# EAGLE design capelet_kinetic (EAGLE 9.5.2)
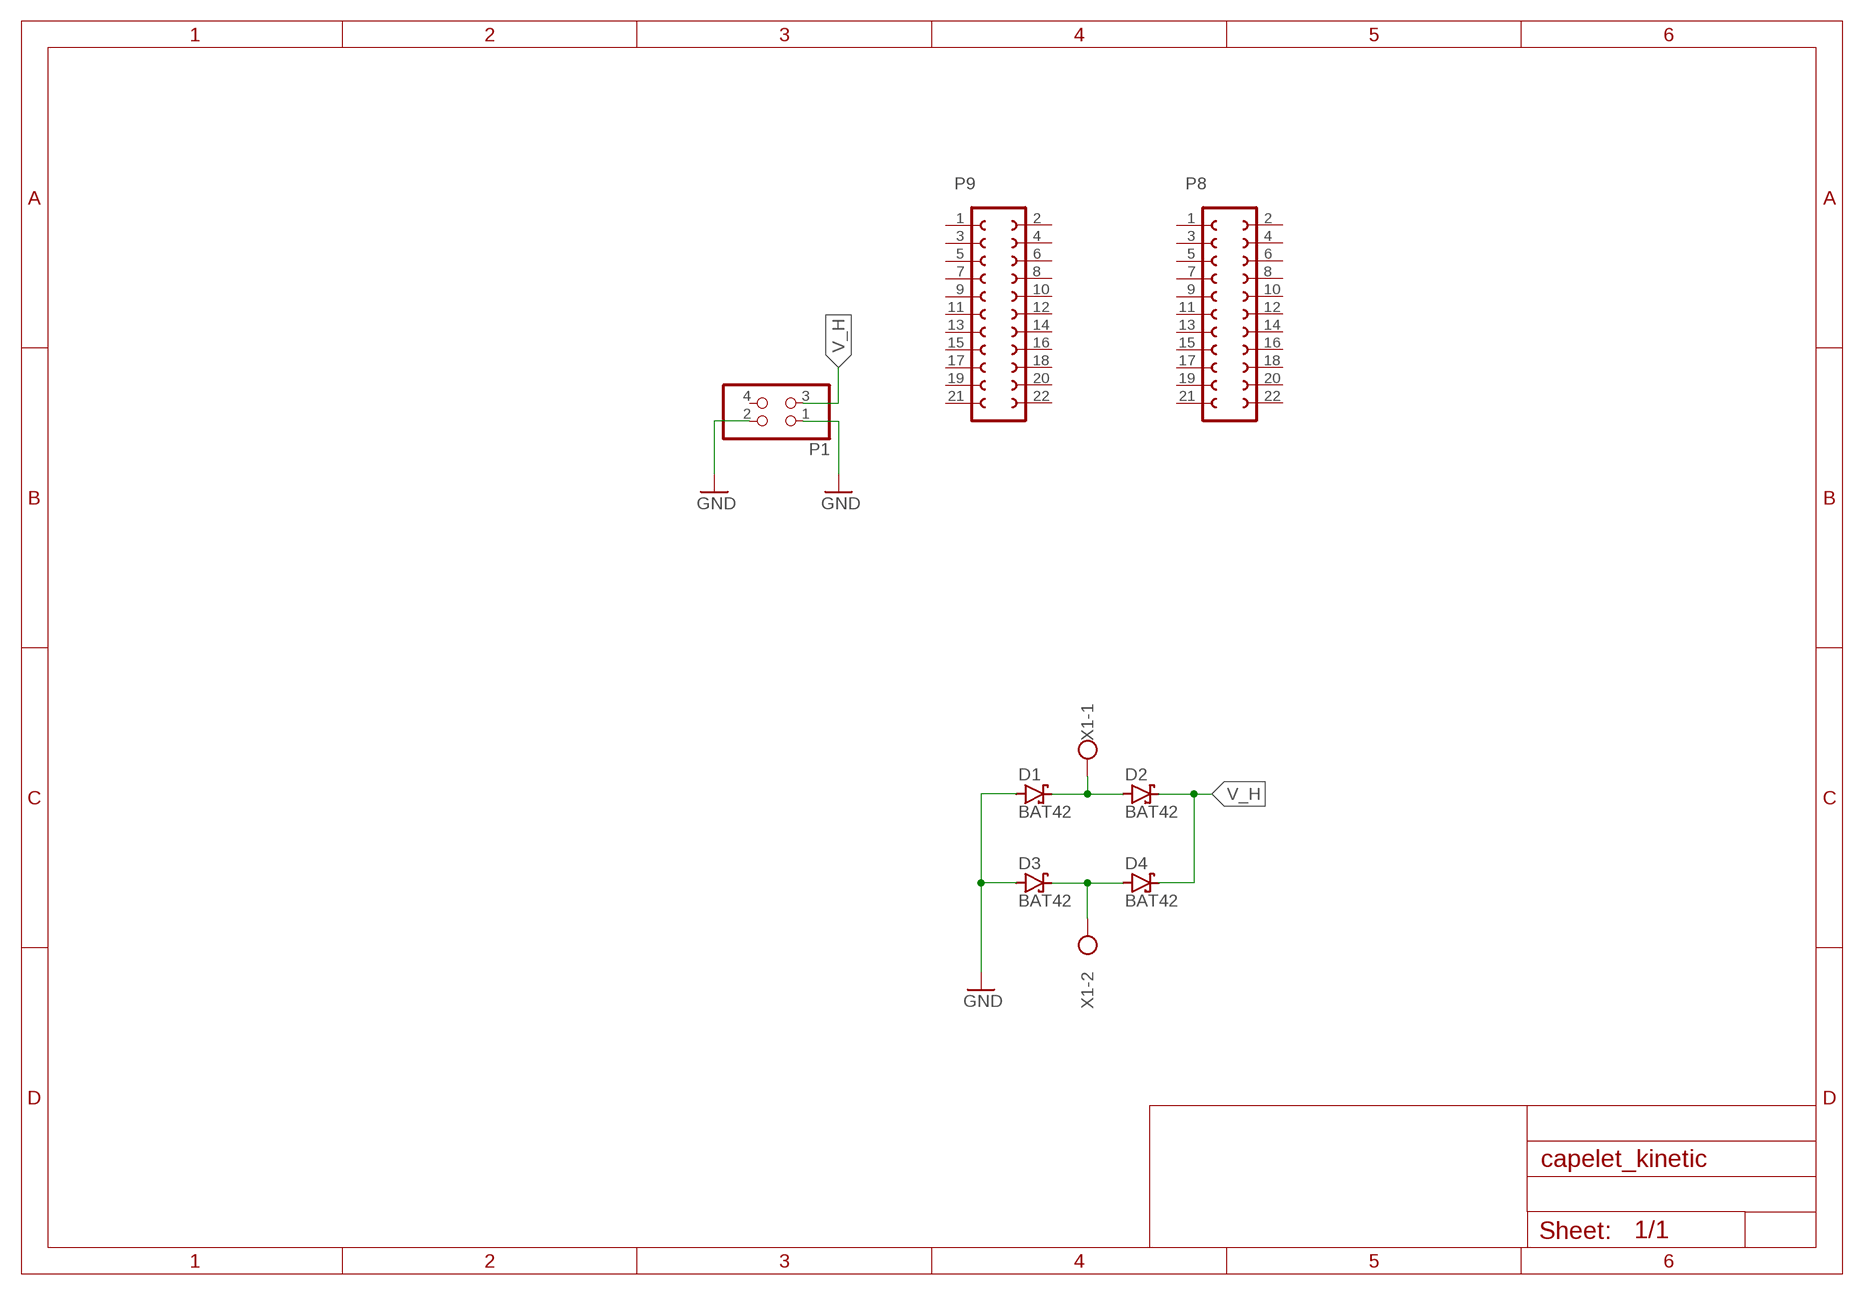
[diagram p0: schematic, sheet 1]

## Parts
D1  BAT42  [DO35-10]
D2  BAT42  [DO35-10]
D3  BAT42  [DO35-10]
D4  BAT42  [DO35-10]
P1  PINHD-2X2  [2X02]
P8  FE11-2  [FE11-2]
P9  FE11-2  [FE11-2]
X1  W237-102  [W237-102]

## Nets
GND: D1.A D3.A P1.1 P1.2
N$5: D1.C D2.A X1.1
N$6: D3.C D4.A X1.2
V_H: D2.C D4.C P1.3
Unconnected: P1.4 P8.1 P8.2 P8.3 P8.4 P8.5 P8.6 P8.7 P8.8 P8.9 P8.10 P8.11 P8.12 P8.13 P8.14 P8.15 P8.16 P8.17 P8.18 P8.19 P8.20 P8.21 P8.22 P9.1 P9.2 P9.3 P9.4 P9.5 P9.6 P9.7 P9.8 P9.9 P9.10 P9.11 P9.12 P9.13 P9.14 P9.15 P9.16 P9.17 P9.18 P9.19 P9.20 P9.21 P9.22

## Library data of the parts
D1-D4 = diode:BAT42: DIODE barrier diode
P1 = pinhead:PINHD-2X2: PIN HEADER
P8 P9 = shepherd:FE11-2
X1 = con-wago-500:W237-102: WAGO SCREW CLAMP; MPN: 237-102; OC_FARNELL: unknown; OC_NEWARK: 70K9898

## Board
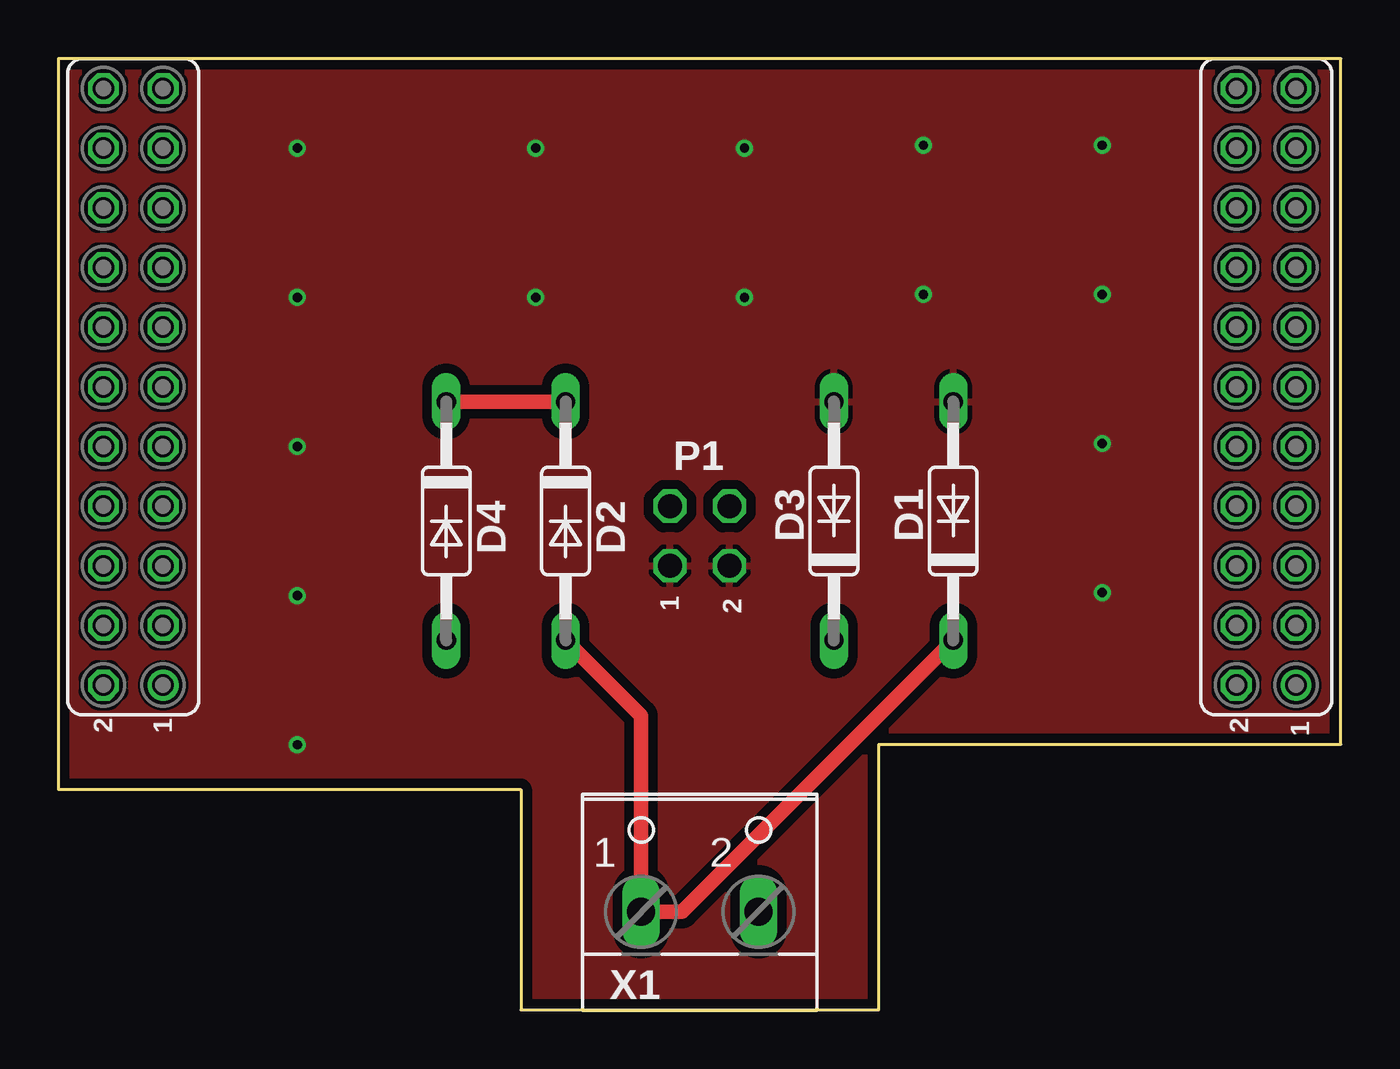
[diagram p1: board, top side]
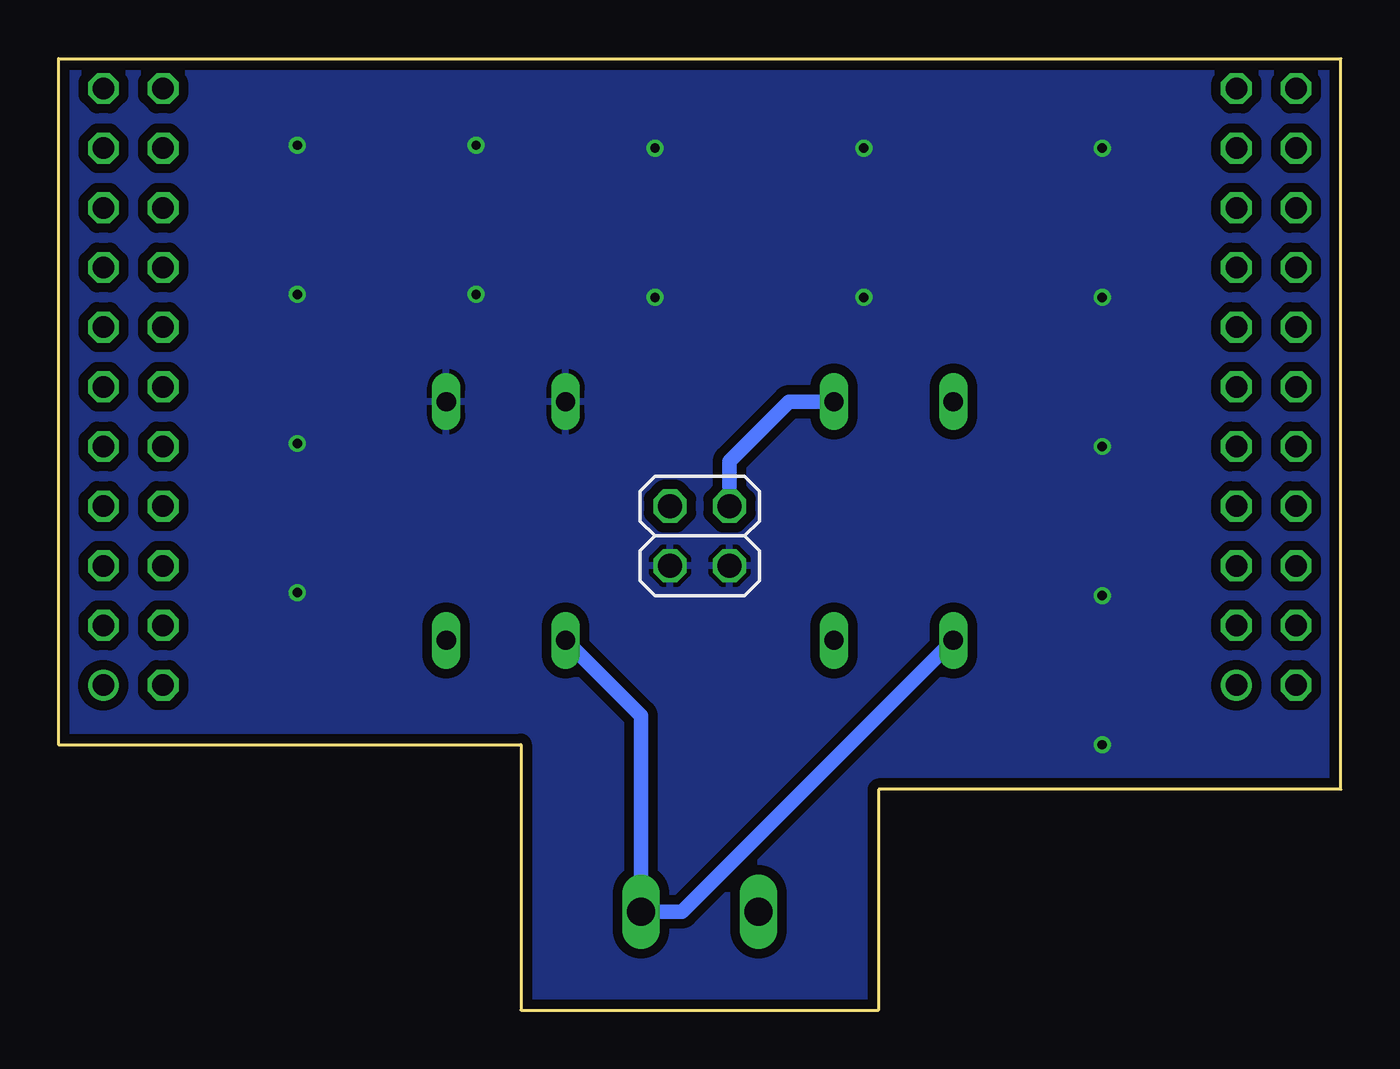
[diagram p2: board, bottom side, seen from below]

Size 54.61 x 40.51 mm. Coordinates in mm from the lower left corner, seen from the top.
Copper layers (1*16): Top 0.035mm / dielectric 1.5mm / Bottom 0.035mm
Design rules "PCB-POOL Standard *": minimum track width 0.15mm, minimum drill 0.3mm, track to track 0.15mm, track to pad 0.15mm, pad to pad 0.15mm, via to via 0.15mm, smd to smd 0.15mm, copper to edge 0.3mm, drill to drill 0.2mm, minimum pad ring 0.2mm, minimum via ring 0.15mm, stop-mask expansion 0.03mm, vias tented up to drill 30mil, thermal gap 0.2mm

### Footprints (pad centres in the part's own frame; a part is rotated, then mirrored left to right if it is on the bottom)
DO35-10 = drill 0.813 long: A 5.08,0; C -5.08,0
2X02 = drill 1.016 octagon: 1 -1.27,-1.27; 2 -1.27,1.27; 3 1.27,-1.27; 4 1.27,1.27
FE11-2 = drill 0.914: 1 12.7,1.27 | drill 0.914 octagon: 2 12.7,-1.27; 3 10.16,1.27; 4 10.16,-1.27; 5 7.62,1.27; 6 7.62,-1.27; 7 5.08,1.27; 8 5.08,-1.27; 9 2.54,1.27; 10 2.54,-1.27; 11 0,1.27; 12 0,-1.27; 13 -2.54,1.27; 14 -2.54,-1.27; 15 -5.08,1.27; 16 -5.08,-1.27; 17 -7.62,1.27; 18 -7.62,-1.27; 19 -10.16,1.27; 20 -10.16,-1.27; 21 -12.7,1.27; 22 -12.7,-1.27
W237-102 = drill 1.194 long: 1 -2.5,-1.27; 2 2.5,-1.27

### Placement (x,y rotation side)
D1  38.1,20.83 90 top
D2  21.59,20.83 270 top
D3  33.02,20.83 90 top
D4  16.51,20.83 270 top
P1  27.3,20.19 90 bottom
P8  3.17,26.54 270 top
P9  51.44,26.54 270 top
U$1  [SHPRD_CPLT_H]  0,0 0 top
X1  27.3,5.46 0 top

### Tracks (layer width: path | path; a pad name or v marks a point on that pad's centre or on a via)
GND  (via drill 0.4)
  other vias: 10.16,36.7 20.32,36.7 29.21,36.7 10.16,30.35 10.16,24 10.16,17.65 10.16,11.3 20.32,30.35 29.21,30.35 36.83,36.83 44.45,36.83 44.45,30.48 36.83,30.48 44.45,24.13 44.45,17.78
  pour Top (isolate 0.406): 0,40.51 54.61,40.51 54.61,0 0,0
  pour Bottom (isolate 0.406): 0,40.51 54.61,40.51 54.61,0 0,0
N$5
  Top 0.61: D1.C 26.54,4.19 X1.1 24.8,12.53 D2.A
N$6
  Bottom 0.61: D4.A 28.07,4.19 X1.2 29.8,12.53 D3.C
V_H
  Top 0.61: D4.C D2.C
  Bottom 0.61: D2.C 23.5,25.91 26.04,23.37 P1.3

### Text on the board
tPlace: 1 | 2 | 2 | 1 | 2 | 1
tStop: SHEPHERD v1.5 CAPELET KEH
Document: P1: Pins pointing to bottom, / solder on top